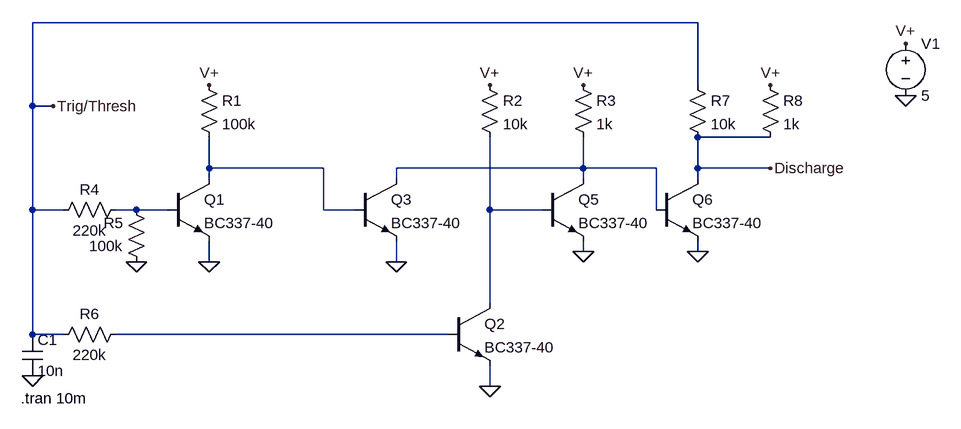
[diagram p0: schematic 555Wannabe.asc]
555Wannabe.asc, the LTspice schematic file:
Version 4
SHEET 1 1296 680
WIRE 928 -160 -96 -160
WIRE 928 -64 928 -160
WIRE -96 -32 -96 -160
WIRE -64 -32 -96 -32
WIRE 1040 16 928 16
WIRE 176 64 176 16
WIRE 352 64 176 64
WIRE 752 64 752 16
WIRE 752 64 464 64
WIRE 864 64 752 64
WIRE 928 64 928 16
WIRE 1040 64 928 64
WIRE 176 80 176 64
WIRE 464 80 464 64
WIRE 752 80 752 64
WIRE 928 80 928 64
WIRE -96 128 -96 -32
WIRE -48 128 -96 128
WIRE 64 128 32 128
WIRE 112 128 64 128
WIRE 352 128 352 64
WIRE 400 128 352 128
WIRE 608 128 608 16
WIRE 688 128 608 128
WIRE 864 128 864 64
WIRE 752 192 752 176
WIRE 928 192 928 176
WIRE 176 208 176 176
WIRE 464 208 464 176
WIRE 608 272 608 128
WIRE -96 320 -96 128
WIRE -48 320 -96 320
WIRE 544 320 32 320
WIRE 608 400 608 368
FLAG 176 208 0
FLAG 608 400 0
FLAG 464 208 0
FLAG 752 192 0
FLAG 176 -64 V+
FLAG 608 -64 V+
FLAG 752 -64 V+
FLAG 64 208 0
FLAG 928 192 0
FLAG -96 384 0
FLAG 1040 -64 V+
FLAG 1248 -48 0
FLAG 1248 -128 V+
FLAG 1040 64 Discharge
FLAG -64 -32 Trig/Thresh
SYMBOL npn 112 80 R0
SYMATTR InstName Q1
SYMATTR Value BC337-40
SYMBOL res 160 -80 R0
SYMATTR InstName R1
SYMATTR Value 100k
SYMBOL res 592 -80 R0
SYMATTR InstName R2
SYMATTR Value 10k
SYMBOL res 736 -80 R0
SYMATTR InstName R3
SYMATTR Value 1k
SYMBOL res 48 112 R90
WINDOW 0 0 56 VBottom 2
WINDOW 3 32 56 VTop 2
SYMATTR InstName R4
SYMATTR Value 220k
SYMBOL res 80 224 R180
WINDOW 0 36 76 Left 2
WINDOW 3 36 40 Left 2
SYMATTR InstName R5
SYMATTR Value 100k
SYMBOL res -64 336 R270
WINDOW 0 32 56 VTop 2
WINDOW 3 0 56 VBottom 2
SYMATTR InstName R6
SYMATTR Value 220k
SYMBOL npn 544 272 R0
SYMATTR InstName Q2
SYMATTR Value BC337-40
SYMBOL npn 400 80 R0
SYMATTR InstName Q3
SYMATTR Value BC337-40
SYMBOL npn 688 80 R0
SYMATTR InstName Q5
SYMATTR Value BC337-40
SYMBOL npn 864 80 R0
SYMATTR InstName Q6
SYMATTR Value BC337-40
SYMBOL res 912 -80 R0
SYMATTR InstName R7
SYMATTR Value 10k
SYMBOL res 1024 -80 R0
SYMATTR InstName R8
SYMATTR Value 1k
SYMBOL cap -112 320 R0
SYMATTR InstName C1
SYMATTR Value 10n
SYMBOL voltage 1248 -144 R0
WINDOW 123 0 0 Left 2
WINDOW 39 0 0 Left 2
SYMATTR InstName V1
SYMATTR Value 5
TEXT -114 418 Left 2 !.tran 10m

The netlist it stands for:
* 555Wannabe.asc
Q1 N001 N003 0 0 BC337-40
R1 V+ N001 100k
R2 V+ N004 10k
R3 V+ N002 1k
R4 N003 Trig/Thresh 220k
R5 0 N003 100k
R6 Trig/Thresh N005 220k
Q2 N004 N005 0 0 BC337-40
Q3 N002 N001 0 0 BC337-40
Q5 N002 N004 0 0 BC337-40
Q6 Discharge N002 0 0 BC337-40
R7 Trig/Thresh Discharge 10k
R8 V+ Discharge 1k
C1 Trig/Thresh 0 10n
V1 V+ 0 5
.model NPN NPN
.model PNP PNP
.lib standard.bjt
.tran 10m
.backanno
.end